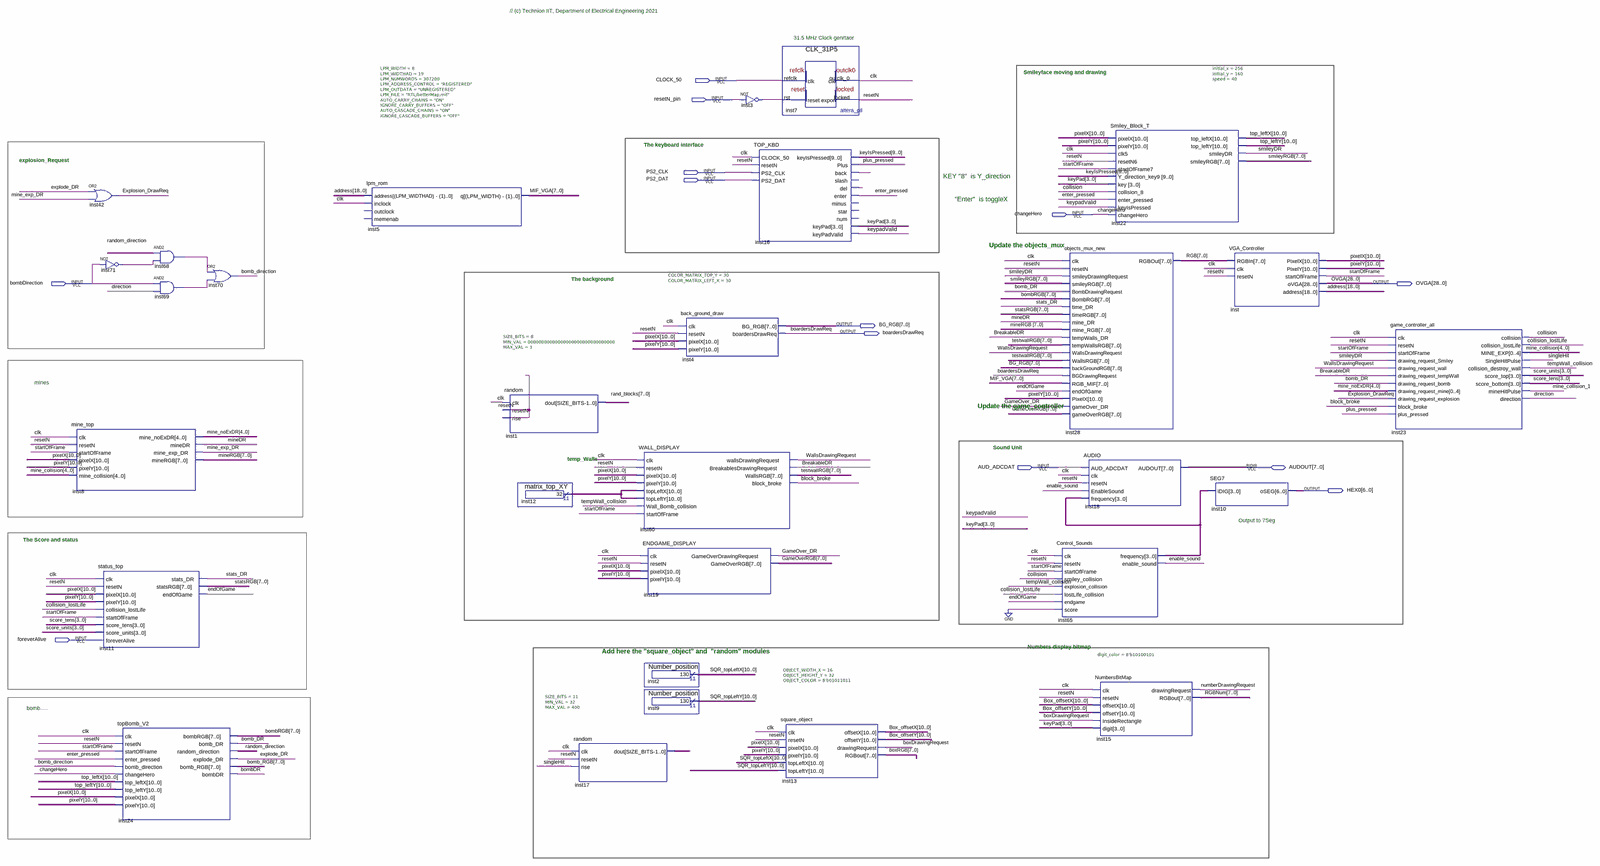
[diagram p0: schematic sheet, whole]
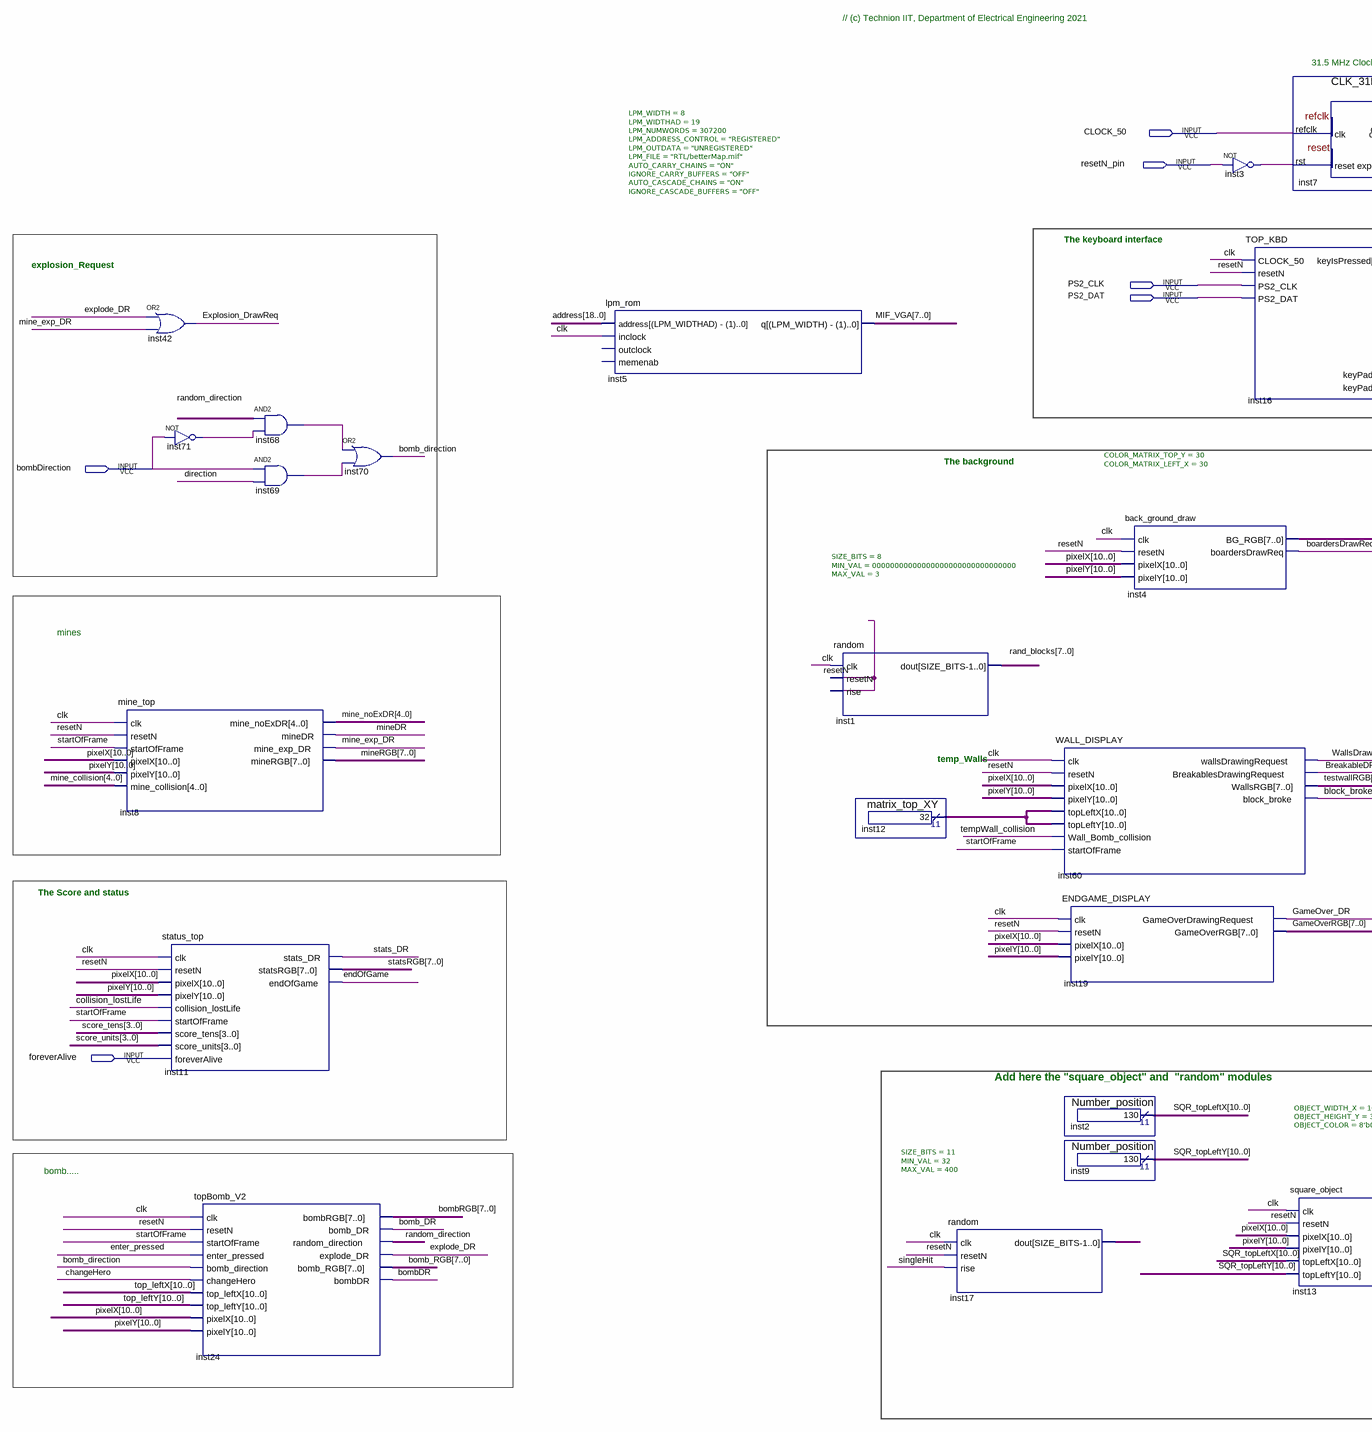
[diagram p1: schematic sheet, left part]
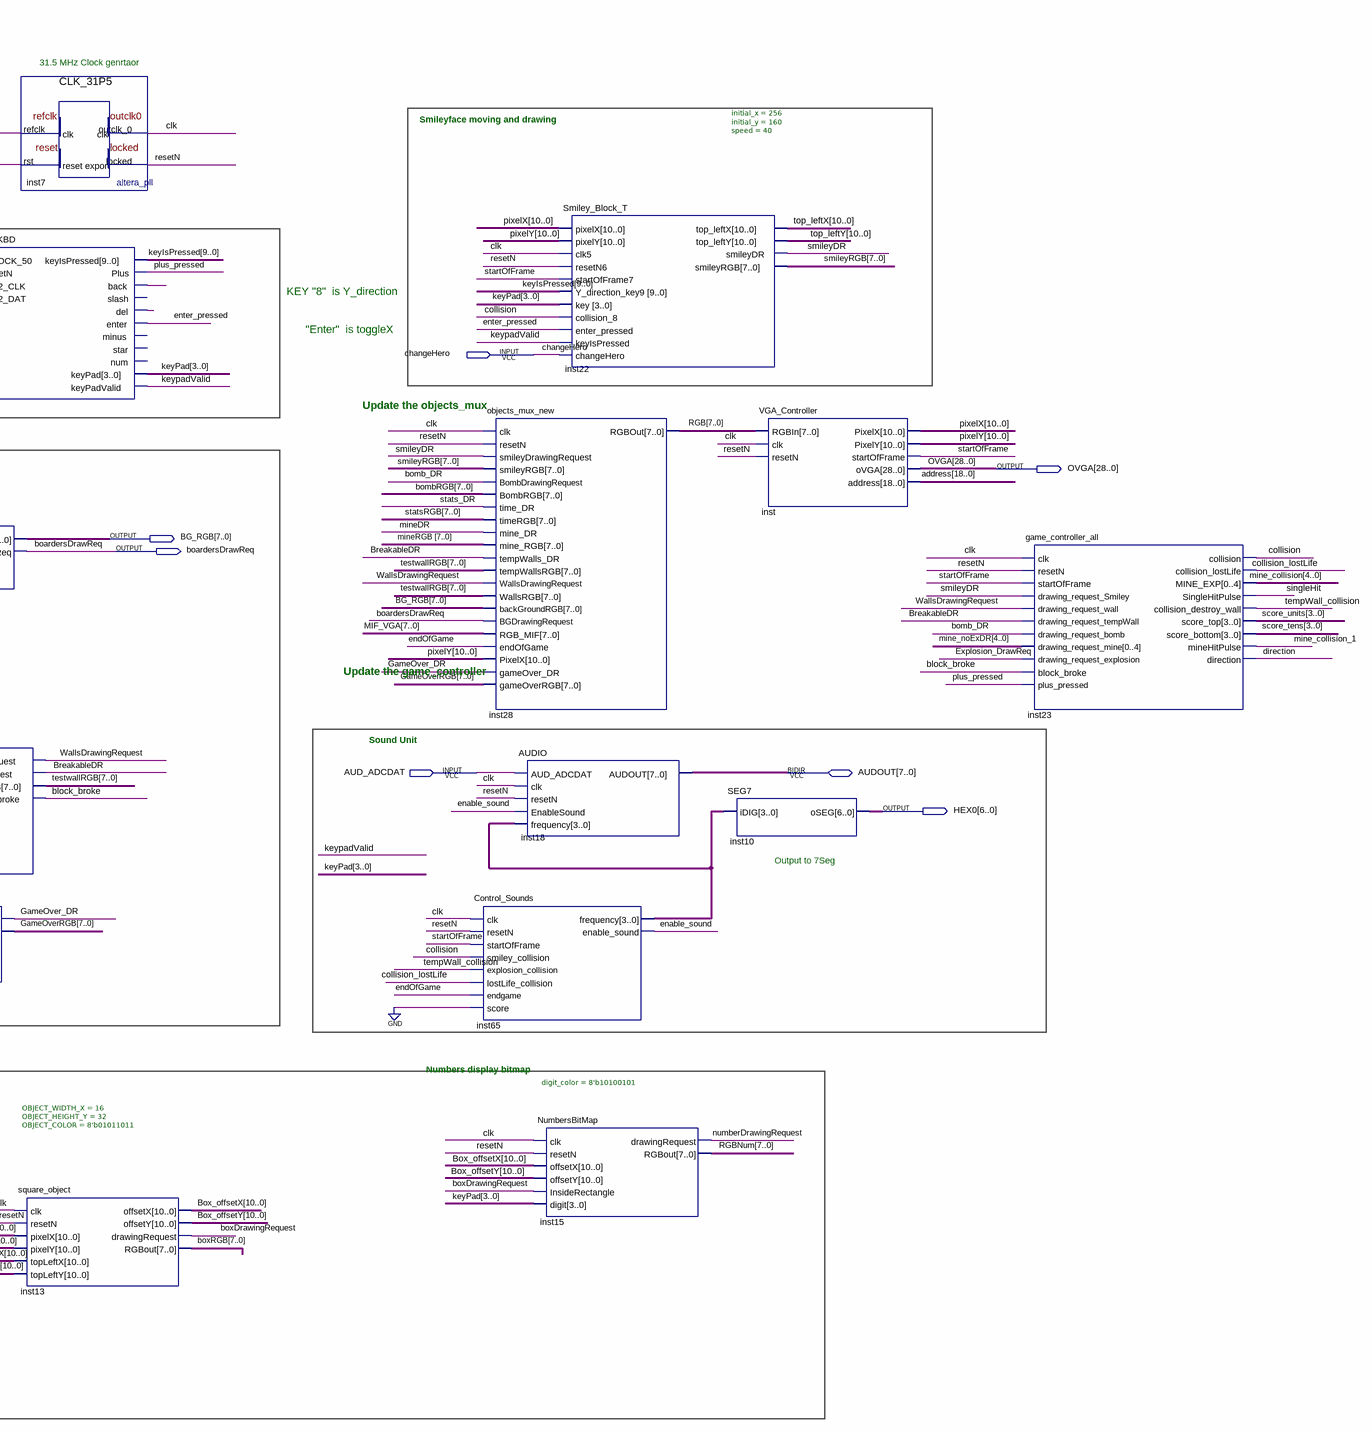
[diagram p2: schematic sheet, right part]
// Quartus schematic TOP_VGA_DEMO_KBD_project.bdf as structural Verilog: 29 symbols, 13 pins
module TOP_VGA_DEMO_KBD_project (
  input  CLOCK_50,
  input  resetN_pin,
  input  PS2_CLK,
  input  PS2_DAT,
  input  changeHero,
  input  bombDirection,
  input  AUD_ADCDAT,
  input  foreverAlive,
  inout  [7:0] AUDOUT,
  output [28:0] OVGA,
  output [7:0] BG_RGB,
  output boardersDrawReq,
  output [6:0] HEX0
);

  wire block_broke, bomb_direction, bomb_DR, bombDR, boxDrawingRequest, BreakableDR, clk, collision,
       collision_lostLife, direction, enable_sound, endOfGame, enter_pressed, explode_DR, Explosion_DrawReq,
       GameOver_DR, inst3_out, inst16_back, inst16_del, inst68_out, inst69_out, inst71_out, keypadValid,
       mine_collision_1, mine_exp_DR, mineDR, numberDrawingRequest, plus_pressed, random_direction, resetN,
       singleHit, smileyDR, startOfFrame, stats_DR, tempWall_collision, WallsDrawingRequest;
  wire [3:0] inst65_frequency, keyPad, score_tens, score_units;
  wire [4:0] mine_collision, mine_noExDR;
  wire [7:0] bomb_RGB, bombRGB, boxRGB, GameOverRGB, MIF_VGA, mineRGB, rand_blocks, RGB, RGBNum, smileyRGB,
       statsRGB, testwallRGB;
  wire [9:0] keyIsPressed;
  wire [10:0] Box_offsetX, Box_offsetY, inst12_result, inst17_dout, pixelX, pixelY, SQR_topLeftX,
       SQR_topLeftY, top_leftX, top_leftY;
  wire [18:0] address;

  or inst42 (Explosion_DrawReq, explode_DR, mine_exp_DR);
  mine_top inst8 (
    .clk(clk), .resetN(resetN), .startOfFrame(startOfFrame), .pixelX(pixelX), .pixelY(pixelY),
    .mine_collision(mine_collision), .mine_noExDR(mine_noExDR), .mineDR(mineDR), .mine_exp_DR(mine_exp_DR),
    .mineRGB(mineRGB));
  not inst71 (inst71_out, bombDirection);
  status_top inst11 (
    .clk(clk), .resetN(resetN), .pixelX(pixelX), .pixelY(pixelY), .collision_lostLife(collision_lostLife),
    .startOfFrame(startOfFrame), .score_tens(score_tens), .score_units(score_units),
    .foreverAlive(foreverAlive), .stats_DR(stats_DR), .statsRGB(statsRGB), .endOfGame(endOfGame));
  topBomb_V2 inst24 (
    .clk(clk), .resetN(resetN), .startOfFrame(startOfFrame), .enter_pressed(enter_pressed),
    .bomb_direction(bomb_direction), .changeHero(changeHero), .top_leftX(top_leftX), .top_leftY(top_leftY),
    .pixelX(pixelX), .pixelY(pixelY), .bombRGB(bombRGB), .bomb_DR(bomb_DR),
    .random_direction(random_direction), .explode_DR(explode_DR), .bomb_RGB(bomb_RGB), .bombDR(bombDR));
  and inst68 (inst68_out, random_direction, inst71_out);
  and inst69 (inst69_out, bombDirection, direction);
  or inst70 (bomb_direction, inst68_out, inst69_out);
  lpm_rom #(.LPM_WIDTH(8), .LPM_WIDTHAD(19), .LPM_NUMWORDS(307200), .LPM_ADDRESS_CONTROL("REGISTERED"), .LPM_OUTDATA("UNREGISTERED"), .LPM_FILE("RTL/betterMap.mif"), .AUTO_CARRY_CHAINS("ON"), .IGNORE_CARRY_BUFFERS("OFF"), .AUTO_CASCADE_CHAINS("ON"), .IGNORE_CASCADE_BUFFERS("OFF")) inst5 (
    .address(address), .inclock(clk), .q(MIF_VGA));  // open: outclock, memenab
  random #(.SIZE_BITS(8), .MIN_VAL(00000000000000000000000000000000), .MAX_VAL(3)) inst1 (
    .clk(clk), .resetN(resetN), .rise(resetN), .dout(rand_blocks));
  matrix_top_XY inst12 (.result(inst12_result));
  random #(.SIZE_BITS(11), .MIN_VAL(32), .MAX_VAL(400)) inst17 (
    .clk(clk), .resetN(resetN), .rise(singleHit), .dout(inst17_dout));
  WALL_DISPLAY inst60 (
    .clk(clk), .resetN(resetN), .pixelX(pixelX), .pixelY(pixelY), .topLeftX(inst12_result),
    .topLeftY(inst12_result), .Wall_Bomb_collision(tempWall_collision), .startOfFrame(startOfFrame),
    .wallsDrawingRequest(WallsDrawingRequest), .BreakablesDrawingRequest(BreakableDR),
    .WallsRGB(testwallRGB), .block_broke(block_broke));
  ENDGAME_DISPLAY inst19 (
    .clk(clk), .resetN(resetN), .pixelX(pixelX), .pixelY(pixelY), .GameOverDrawingRequest(GameOver_DR),
    .GameOverRGB(GameOverRGB));
  Number_position inst2 (.result(SQR_topLeftX));
  Number_position inst9 (.result(SQR_topLeftY));
  back_ground_draw #(.COLOR_MATRIX_TOP_Y(30), .COLOR_MATRIX_LEFT_X(30)) inst4 (
    .clk(clk), .resetN(resetN), .pixelX(pixelX), .pixelY(pixelY), .BG_RGB(BG_RGB),
    .boardersDrawReq(boardersDrawReq));
  not inst3 (inst3_out, resetN_pin);
  TOP_KBD inst16 (
    .CLOCK_50(clk), .resetN(resetN), .PS2_CLK(PS2_CLK), .PS2_DAT(PS2_DAT), .keyIsPressed(keyIsPressed),
    .Plus(plus_pressed), .back(inst16_back), .del(inst16_del), .enter(enter_pressed), .keyPad(keyPad),
    .keyPadValid(keypadValid));  // open: slash, minus, star, num
  CLK_31P5 inst7 (.refclk(CLOCK_50), .rst(inst3_out), .outclk_0(clk), .locked(resetN));
  square_object #(.OBJECT_WIDTH_X(16), .OBJECT_HEIGHT_Y(32), .OBJECT_COLOR(8'b01011011)) inst13 (
    .clk(clk), .resetN(resetN), .pixelX(pixelX), .pixelY(pixelY), .topLeftX(SQR_topLeftX),
    .topLeftY(SQR_topLeftY), .offsetX(Box_offsetX), .offsetY(Box_offsetY),
    .drawingRequest(boxDrawingRequest), .RGBout(boxRGB));
  objects_mux_new inst28 (
    .clk(clk), .resetN(resetN), .smileyDrawingRequest(smileyDR), .smileyRGB(smileyRGB),
    .BombDrawingRequest(bomb_DR), .BombRGB(bombRGB), .time_DR(stats_DR), .timeRGB(statsRGB),
    .mine_DR(mineDR), .mine_RGB(mineRGB), .tempWalls_DR(BreakableDR), .tempWallsRGB(testwallRGB),
    .WallsDrawingRequest(WallsDrawingRequest), .WallsRGB(testwallRGB), .backGroundRGB(BG_RGB),
    .BGDrawingRequest(boardersDrawReq), .RGB_MIF(MIF_VGA), .endOfGame(endOfGame), .PixelX(pixelY),
    .gameOver_DR(GameOver_DR), .gameOverRGB(GameOverRGB), .RGBOut(RGB));
  Control_Sounds inst65 (
    .clk(clk), .resetN(resetN), .startOfFrame(startOfFrame), .smiley_collision(collision),
    .explosion_collision(tempWall_collision), .lostLife_collision(collision_lostLife), .endgame(endOfGame),
    .score(1'b0), .frequency(inst65_frequency), .enable_sound(enable_sound));
  AUDIO inst18 (
    .AUD_ADCDAT(AUD_ADCDAT), .clk(clk), .resetN(resetN), .EnableSound(enable_sound),
    .frequency(inst65_frequency), .AUDOUT(AUDOUT));
  NumbersBitMap #(.digit_color(8'b10100101)) inst15 (
    .clk(clk), .resetN(resetN), .offsetX(Box_offsetX), .offsetY(Box_offsetY),
    .InsideRectangle(boxDrawingRequest), .digit(keyPad), .drawingRequest(numberDrawingRequest),
    .RGBout(RGBNum));
  Smiley_Block_T #(.initial_x(256), .initial_y(160), .speed(40)) inst22 (
    .pixelX(pixelX), .pixelY(pixelY), .clk5(clk), .resetN6(resetN), .startOfFrame7(startOfFrame),
    .Y_direction_key9(keyIsPressed), .key(keyPad), .collision_8(collision), .enter_pressed(enter_pressed),
    .keyIsPressed(keypadValid), .changeHero(changeHero), .top_leftX(top_leftX), .top_leftY(top_leftY),
    .smileyDR(smileyDR), .smileyRGB(smileyRGB));
  VGA_Controller inst (
    .RGBIn(RGB), .clk(clk), .resetN(resetN), .PixelX(pixelX), .PixelY(pixelY), .startOfFrame(startOfFrame),
    .oVGA(OVGA), .address(address));
  SEG7 inst10 (.iDIG(inst65_frequency), .oSEG(HEX0));
  game_controller_all inst23 (
    .clk(clk), .resetN(resetN), .startOfFrame(startOfFrame), .drawing_request_Smiley(smileyDR),
    .drawing_request_wall(WallsDrawingRequest), .drawing_request_tempWall(BreakableDR),
    .drawing_request_bomb(bomb_DR), .drawing_request_mine(mine_noExDR),
    .drawing_request_explosion(Explosion_DrawReq), .block_broke(block_broke), .plus_pressed(plus_pressed),
    .collision(collision), .collision_lostLife(collision_lostLife), .MINE_EXP(mine_collision),
    .SingleHitPulse(singleHit), .collision_destroy_wall(tempWall_collision), .score_top(score_units),
    .score_bottom(score_tens), .mineHitPulse(mine_collision_1), .direction(direction));

  // Notes on the sheet:
  //   // (c) Technion IIT, Department of Electrical Engineering 2021
  //   31.5 MHz Clock genrtaor
  //   Smileyface moving and drawing
  //   The keyboard interface
  //   explosion_Request
  //   KEY "8"  is Y_direction
  //   "Enter"  is toggleX
  //   Update the objects_mux
  //   The background
  //   mines 
  //   Update the game_controller
  //   Sound Unit
  //   temp_Walls
  //   Output to 7Seg
  //   The Score and status
  //   Numbers display bitmap
  //   Add here the "square_object" and  "random" modules
  //   bomb.....
endmodule
